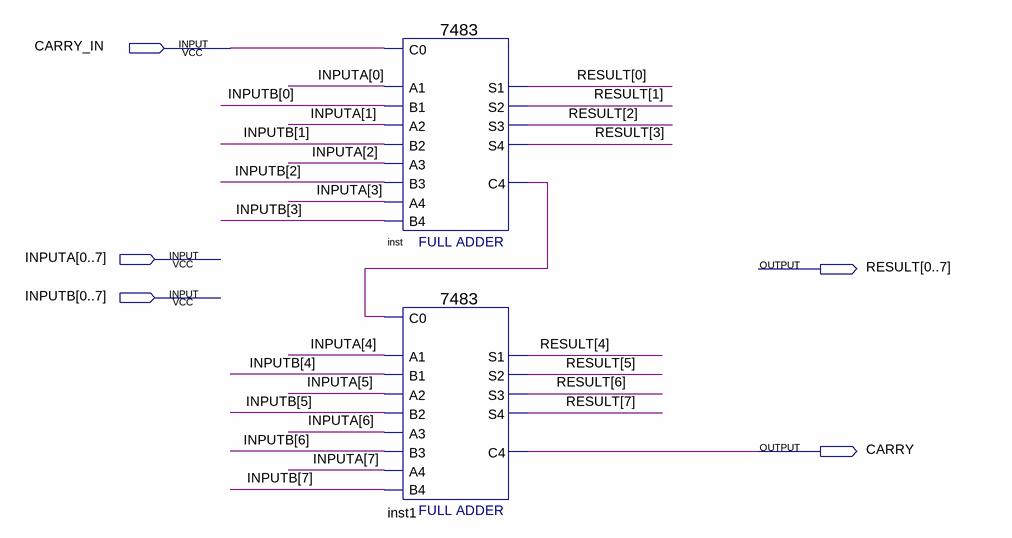
[diagram p0: schematic sheet]
// Quartus schematic blocksumador8.bdf as structural Verilog: 2 symbols, 5 pins
module blocksumador8 (
  input  CARRY_IN,
  input  [0:7] INPUTA,
  input  [0:7] INPUTB,
  output [0:7] RESULT,
  output CARRY
);

  wire inst_c4;

  \7483  inst (
    .B4(INPUTB[3]), .C0(CARRY_IN), .A1(INPUTA[0]), .A2(INPUTA[1]), .B1(INPUTB[0]), .B2(INPUTB[1]),
    .A3(INPUTA[2]), .B3(INPUTB[2]), .A4(INPUTA[3]), .S3(RESULT[2]), .S4(RESULT[3]), .S2(RESULT[1]),
    .C4(inst_c4), .S1(RESULT[0]));
  \7483  inst1 (
    .B4(INPUTB[7]), .C0(inst_c4), .A1(INPUTA[4]), .A2(INPUTA[5]), .B1(INPUTB[4]), .B2(INPUTB[5]),
    .A3(INPUTA[6]), .B3(INPUTB[6]), .A4(INPUTA[7]), .S3(RESULT[6]), .S4(RESULT[7]), .S2(RESULT[5]),
    .C4(CARRY), .S1(RESULT[4]));
endmodule
